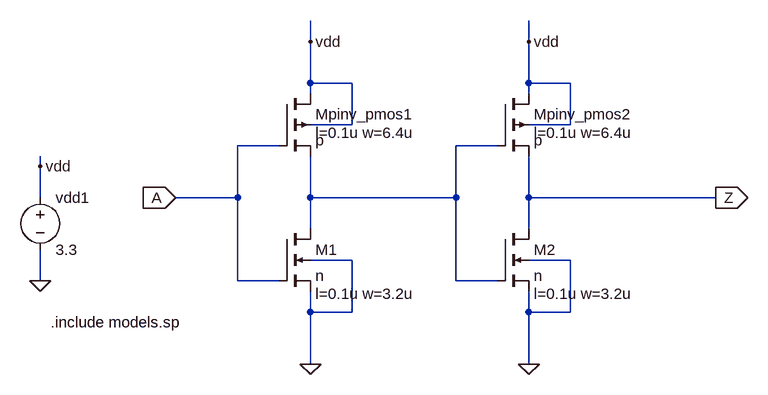
[diagram p0: schematic buff_power.asc]
buff_power.asc, the LTspice schematic file:
Version 4
SHEET 1 936 680
WIRE 240 -96 240 -128
WIRE 576 -96 576 -128
WIRE 240 -32 240 -96
WIRE 304 -32 240 -32
WIRE 576 -32 576 -96
WIRE 640 -32 576 -32
WIRE 240 -16 240 -32
WIRE 576 -16 576 -32
WIRE 304 32 304 -32
WIRE 304 32 240 32
WIRE 640 32 640 -32
WIRE 640 32 576 32
WIRE 192 64 128 64
WIRE 528 64 464 64
WIRE -176 96 -176 80
WIRE -176 144 -176 96
WIRE 128 144 128 64
WIRE 128 144 32 144
WIRE 240 144 240 80
WIRE 464 144 464 64
WIRE 464 144 240 144
WIRE 576 144 576 80
WIRE 864 144 576 144
WIRE 240 192 240 144
WIRE 576 192 576 144
WIRE 304 240 240 240
WIRE 640 240 576 240
WIRE -176 272 -176 224
WIRE 128 272 128 144
WIRE 192 272 128 272
WIRE 464 272 464 144
WIRE 528 272 464 272
WIRE 240 320 240 288
WIRE 304 320 304 240
WIRE 304 320 240 320
WIRE 576 320 576 288
WIRE 640 320 640 240
WIRE 640 320 576 320
WIRE 240 400 240 320
WIRE 576 400 576 320
FLAG 32 144 A
IOPIN 32 144 In
FLAG 864 144 Z
IOPIN 864 144 Out
FLAG 240 400 0
FLAG -176 272 0
FLAG 240 -96 vdd
FLAG -176 96 vdd
FLAG 576 400 0
FLAG 576 -96 vdd
SYMBOL nmos4 192 192 R0
WINDOW 123 56 100 Left 2
SYMATTR Value2 l=0.1u w=3.2u
SYMATTR InstName M1
SYMATTR Value n
SYMBOL pmos4 192 -16 R0
WINDOW 123 56 60 Left 2
SYMATTR Value2 l=0.1u w=6.4u
SYMATTR InstName Mpinv_pmos1
SYMATTR Value p
SYMBOL voltage -176 128 R0
SYMATTR InstName vdd1
SYMATTR Value 3.3
SYMBOL nmos4 528 192 R0
WINDOW 123 56 100 Left 2
SYMATTR Value2 l=0.1u w=3.2u
SYMATTR InstName M2
SYMATTR Value n
SYMBOL pmos4 528 -16 R0
WINDOW 123 56 60 Left 2
SYMATTR Value2 l=0.1u w=6.4u
SYMATTR InstName Mpinv_pmos2
SYMATTR Value p
TEXT -160 336 Left 2 !.include models.sp

The netlist it stands for:
* buff_power.asc
M1 N001 A 0 0 n l=0.1u w=3.2u
Mpinv_pmos1 vdd A N001 vdd p l=0.1u w=6.4u
vdd1 vdd 0 3.3
M2 Z N001 0 0 n l=0.1u w=3.2u
Mpinv_pmos2 vdd N001 Z vdd p l=0.1u w=6.4u
.model NMOS NMOS
.model PMOS PMOS
.lib standard.mos
.include models.sp
.backanno
.end